# Altium schematic sheet MAIN_PILL_SCH.SchDoc
size 420 x 260 mm; SheetNumber: 1; SheetTotal: 1
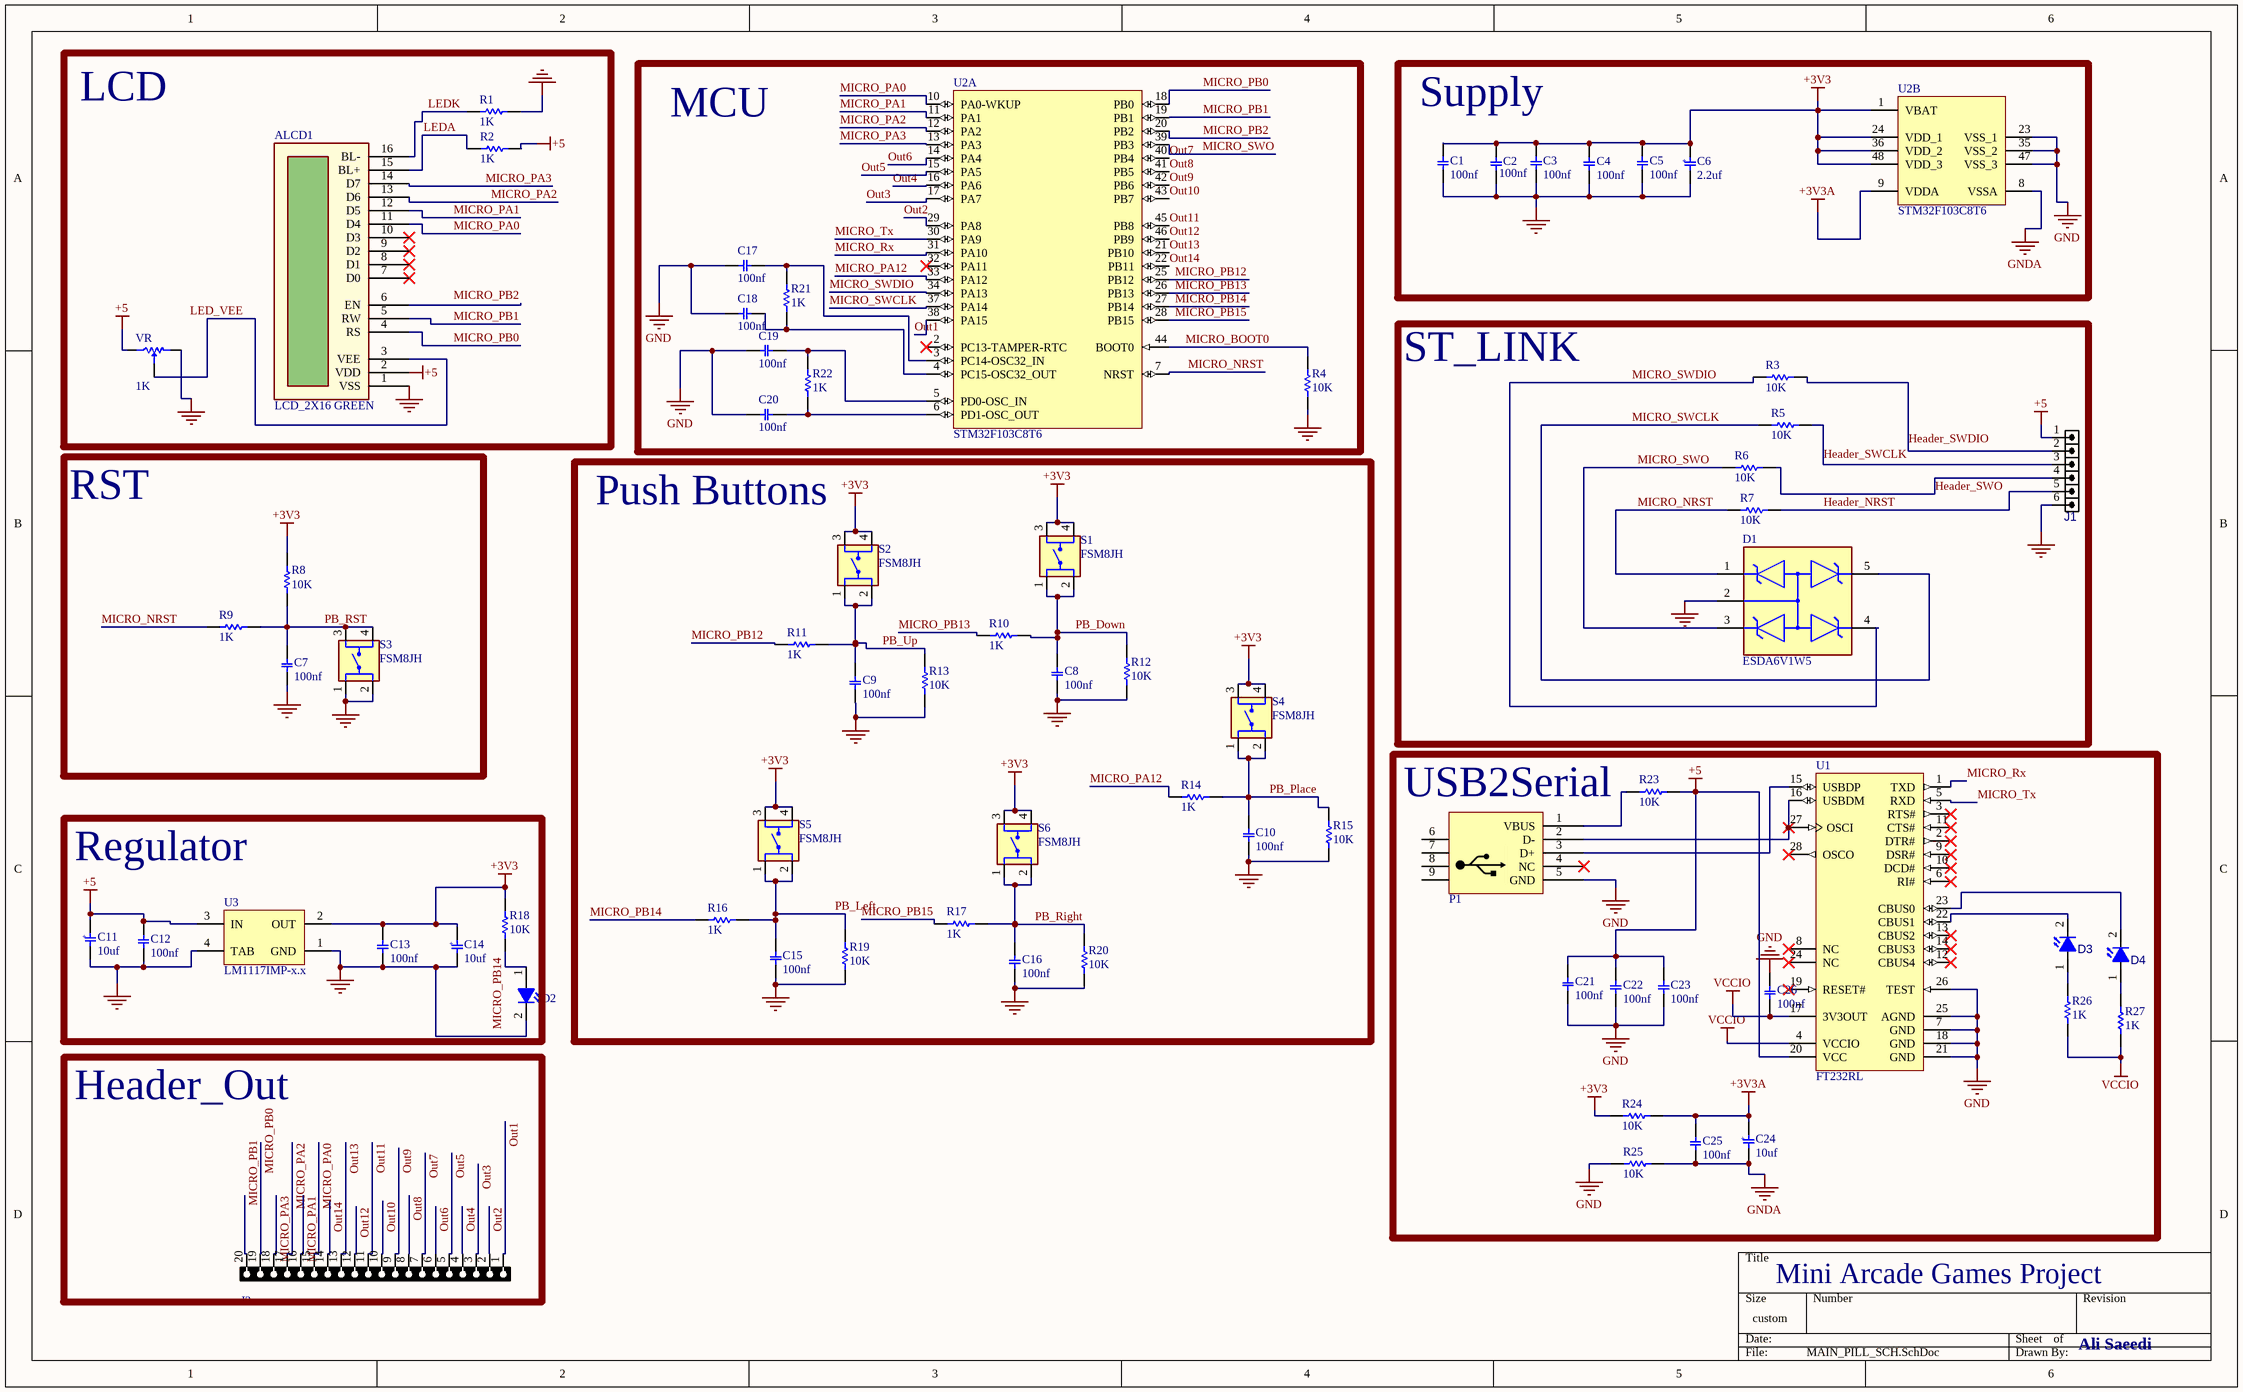
[diagram p0: MAIN_PILL_SCH.SchDoc]

## Parts
ALCD1  LCD_2X16 GREEN  [LCD_2X16 GREEN]
C1  value 100nf  [C0805]  (hidden comment: Capacitor C SMD 0805)
C2  value 100nf  [C0805]  (hidden comment: Capacitor C SMD 0805)
C3  value 100nf  [C0805]  (hidden comment: Capacitor C SMD 0805)
C4  value 100nf  [C0805]  (hidden comment: Capacitor C SMD 0805)
C5  value 100nf  [C0805]  (hidden comment: Capacitor C SMD 0805)
C6  value 2.2uf  [Cap_2_(2.5mm)]  (hidden comment: Capacitor Electrical THD)
C7  value 100nf  [C0805]  (hidden comment: Capacitor C SMD 0805)
C8  value 100nf  [C0805]  (hidden comment: Capacitor C SMD 0805)
C9  value 100nf  [C0805]  (hidden comment: Capacitor C SMD 0805)
C10  value 100nf  [C0805]  (hidden comment: Capacitor C SMD 0805)
C11  value 10uf  [Cap_2_(2.5mm)]  (hidden comment: Capacitor Electrical THD)
C12  value 100nf  [C0805]  (hidden comment: Capacitor C SMD 0805)
C13  value 100nf  [C0805]  (hidden comment: Capacitor C SMD 0805)
C14  value 10uf  [Cap_2_(2.5mm)]  (hidden comment: Capacitor Electrical THD)
C15  value 100nf  [C0805]  (hidden comment: Capacitor C SMD 0805)
C16  value 100nf  [C0805]  (hidden comment: Capacitor C SMD 0805)
C17  value 100nf  [C0805]  (hidden comment: Capacitor C SMD 0805)
C18  value 100nf  [C0805]  (hidden comment: Capacitor C SMD 0805)
C19  value 100nf  [C0805]  (hidden comment: Capacitor C SMD 0805)
C20  value 100nf  [C0805]  (hidden comment: Capacitor C SMD 0805)
C21  value 100nf  [C0805]  (hidden comment: Capacitor C SMD 0805)
C22  value 100nf  [C0805]  (hidden comment: Capacitor C SMD 0805)
C23  value 100nf  [C0805]  (hidden comment: Capacitor C SMD 0805)
C24  value 10uf  [Cap_2_(2.5mm)]  (hidden comment: Capacitor Electrical THD)
C25  value 100nf  [C0805]  (hidden comment: Capacitor C SMD 0805)
C26  value 100nf  [C0805]  (hidden comment: Capacitor C SMD 0805)
D1  ESDA6V1W5  [FP-SOT323-5L-MFG]
D2  LED THD 5mm  [LED THD 5mm (Green)]  (value not drawn)
D3  LED SMD 1206  [LED SMD 1206 (Blue)]  (value not drawn)
D4  LED SMD 1206  [LED SMD 1206 (Blue)]  (value not drawn)
J1  HDRM6  [HDRS_M_1X6]  (value not drawn)
J2  HDRF20  [HDR_F_1X20]  (value not drawn)
P1  USB mini  [USB/SM0.8-6H5]  (value not drawn)
R1  value 1K  [SMD-1206-RES]  (hidden comment: Resistor SMD 1206)
R2  value 1K  [SMD-1206-RES]  (hidden comment: Resistor SMD 1206)
R3  value 10K  [SMD-1206-RES]  (hidden comment: Resistor SMD 1206)
R4  value 10K  [SMD-1206-RES]  (hidden comment: Resistor SMD 1206)
R5  value 10K  [SMD-1206-RES]  (hidden comment: Resistor SMD 1206)
R6  value 10K  [SMD-1206-RES]  (hidden comment: Resistor SMD 1206)
R7  value 10K  [SMD-1206-RES]  (hidden comment: Resistor SMD 1206)
R8  value 10K  [SMD-1206-RES]  (hidden comment: Resistor SMD 1206)
R9  value 1K  [SMD-1206-RES]  (hidden comment: Resistor SMD 1206)
R10  value 1K  [SMD-1206-RES]  (hidden comment: Resistor SMD 1206)
R11  value 1K  [SMD-1206-RES]  (hidden comment: Resistor SMD 1206)
R12  value 10K  [SMD-1206-RES]  (hidden comment: Resistor SMD 1206)
R13  value 10K  [SMD-1206-RES]  (hidden comment: Resistor SMD 1206)
R14  value 1K  [SMD-1206-RES]  (hidden comment: Resistor SMD 1206)
R15  value 10K  [SMD-1206-RES]  (hidden comment: Resistor SMD 1206)
R16  value 1K  [SMD-1206-RES]  (hidden comment: Resistor SMD 1206)
R17  value 1K  [SMD-1206-RES]  (hidden comment: Resistor SMD 1206)
R18  value 10K  [SMD-1206-RES]  (hidden comment: Resistor SMD 1206)
R19  value 10K  [SMD-1206-RES]  (hidden comment: Resistor SMD 1206)
R20  value 10K  [SMD-1206-RES]  (hidden comment: Resistor SMD 1206)
R21  value 1K  [R2W_AX_VER]  (hidden comment: Resistor THD)
R22  value 1K  [R2W_AX_VER]  (hidden comment: Resistor THD)
R23  value 10K  [SMD-1206-RES]  (hidden comment: Resistor SMD 1206)
R24  value 10K  [SMD-1206-RES]  (hidden comment: Resistor SMD 1206)
R25  value 10K  [SMD-1206-RES]  (hidden comment: Resistor SMD 1206)
R26  value 1K  [SMD-1206-RES]  (hidden comment: Resistor SMD 1206)
R27  value 1K  [SMD-1206-RES]  (hidden comment: Resistor SMD 1206)
S1  FSM8JH  [SW_FSM8JH]
S2  FSM8JH  [SW_FSM8JH]
S3  FSM8JH  [SW_FSM8JH]
S4  FSM8JH  [SW_FSM8JH]
S5  FSM8JH  [SW_FSM8JH]
S6  FSM8JH  [SW_FSM8JH]
U1  FT232RL  [FTDI-SSOP-28_M]
U2  STM32F103C8T6  [STM-LQFP48_N]  (parts A,B of 2)
U3  LM1117IMP-x.x  [SOT223]
VR  value 1K  [Volume]  (hidden comment: Volume)

## Blocks framed on the sheet
LCD: ALCD1 R1 R2 VR
MCU: C17-C20 R4 R21 R22 U2
Supply: C1-C6 U2
ST_LINK: D1 J1 R3 R5-R7
RST: C7 R8 R9 S3
Push Buttons: C8-C10 C15 C16 R10-R17 R19 R20 S1 S2 S4-S6
USB2Serial: C21-C26 D3 D4 P1 R23-R27 U1
Regulator: C11-C14 D2 R18 U3
Header_Out: J2

## Nets
+3V3: C1.2 C2.2 C3.2 C4.2 C5.2 C6.1 C13.2 C14.1 R8.2 R18.2 R24.1 S1.3 S1.4 S2.3 S2.4 S4.3 S4.4 S5.3 S5.4 S6.3 S6.4 U2.1(VBAT) U2.24(VDD_1) U2.36(VDD_2) U2.48(VDD_3) U3.2(OUT)
+3V3A: C24.1 C25.2 R24.2 U2.9(VDDA)
+5: ALCD1.2(VDD) C11.1 C12.2 C21.2 C22.2 C23.2 J1.1 R2.2 R23.2 U1.20(VCC) U3.3(IN) VR.1(CCW)
GND: ALCD1.1(VSS) C1.1 C2.1 C3.1 C4.1 C5.1 C6.2 C7.1 C8.1 C9.1 C10.1 C11.2 C12.1 C13.1 C14.2 C15.1 C16.1 C17.2 C18.2 C19.2 C20.2 C21.1 C22.1 C23.1 C26.2 D1.2(COMMON_ANODE) D2.2(CATHODE) J1.6 P1.5(GND) R1.2 R4.1 R12.1 R13.1 R15.1 R19.1 R20.1 R25.1 S3.1 S3.2 U1.7(GND) U1.18(GND) U1.21(GND) U1.25(AGND) U1.26(TEST) U2.23(VSS_1) U2.35(VSS_2) U2.47(VSS_3) U3.1(GND) U3.4(TAB) VR.2(CW)
GNDA: C24.2 C25.1 R25.2 U2.8(VSSA)
VCCIO: C26.1 R26.1 R27.1 U1.4(VCCIO) U1.17(3V3OUT)
Header_NRST: J1.5 R7.2
Header_SWCLK: J1.3 R5.2
Header_SWDIO: J1.2 R3.2
Header_SWO: J1.4 R6.2
LED_VEE: ALCD1.3(VEE) VR.3(Setpoint)
LEDA: ALCD1.15(BL+) R2.1
LEDK: ALCD1.16(BL-) R1.1
MICRO_BOOT0: R4.2 U2.44(BOOT0)
MICRO_NRST: D1.1(1_CATHODE) R7.1 R9.2 U2.7(NRST)
MICRO_PA0: ALCD1.11(D4) J2.15 U2.10(PA0-WKUP)
MICRO_PA1: ALCD1.12(D5) J2.16 U2.11(PA1)
MICRO_PA2: ALCD1.13(D6) J2.17 U2.12(PA2)
MICRO_PA3: ALCD1.14(D7) J2.18 U2.13(PA3)
MICRO_PA12: R14.2 U2.33(PA12)
MICRO_PB0: ALCD1.4(RS) J2.19 U2.18(PB0)
MICRO_PB1: ALCD1.5(RW) J2.20 U2.19(PB1)
MICRO_PB2: ALCD1.6(EN) U2.20(PB2)
MICRO_PB12: R11.2 U2.25(PB12)
MICRO_PB13: R10.2 U2.26(PB13)
MICRO_PB14: D2.1(ANODE) R16.2 R18.1 U2.27(PB14)
MICRO_PB15: R17.2 U2.28(PB15)
MICRO_Rx: U1.1(TXD) U2.31(PA10)
MICRO_SWCLK: D1.5(4_CATHODE) R5.1 U2.37(PA14)
MICRO_SWDIO: D1.4(3_CATHODE) R3.1 U2.34(PA13)
MICRO_SWO: D1.3(2_CATHODE) R6.1 U2.39(PB3)
MICRO_Tx: U1.5(RXD) U2.30(PA9)
Out1: J2.1 U2.38(PA15)
Out2: J2.2 U2.29(PA8)
Out3: J2.3 U2.17(PA7)
Out4: J2.4 U2.16(PA6)
Out5: J2.5 U2.15(PA5)
Out6: J2.6 U2.14(PA4)
Out7: J2.7 U2.40(PB4)
Out8: J2.8 U2.41(PB5)
Out9: J2.9 U2.42(PB6)
Out10: J2.10 U2.43(PB7)
Out11: J2.11 U2.45(PB8)
Out12: J2.12 U2.46(PB9)
Out13: J2.13 U2.21(PB10)
Out14: J2.14 U2.22(PB11)
PB_Down: C8.2 R10.1 R12.2 S1.1 S1.2
PB_Left: C15.2 R16.1 R19.2 S5.1 S5.2
PB_Place: C10.2 R14.1 R15.2 S4.1 S4.2
PB_Right: C16.2 R17.1 R20.2 S6.1 S6.2
PB_RST: C7.2 R8.1 R9.1 S3.3 S3.4
PB_Up: C9.2 R11.1 R13.2 S2.1 S2.2
NetC17_1: C17.1 R21.2 U2.3(PC14-OSC32_IN)
NetC18_1: C18.1 R21.1 U2.4(PC15-OSC32_OUT)
NetC19_1: C19.1 R22.2 U2.5(PD0-OSC_IN)
NetC20_1: C20.1 R22.1 U2.6(PD1-OSC_OUT)
NetD3_1: D3.1(ANODE) R26.2
NetD3_2: D3.2(CATHODE) U1.22(CBUS1)
NetD4_1: D4.1(ANODE) R27.2
NetD4_2: D4.2(CATHODE) U1.23(CBUS0)
NetP1_1: P1.1(VBUS) R23.1
NetP1_2: P1.2(D-) U1.16(USBDM) U1.27(OSCI)
NetP1_3: P1.3(D+) U1.15(USBDP)

Not connected (* = marked no-connect by the designer): ALCD1 7(D0)* 8(D1)* 9(D2)* 10(D3)*; P1 4(NC)* 6 7 8 9; U1 2(DTR#)* 3(RTS#)* 6(RI#)* 8(NC)* 9(DSR#)* 10(DCD#)* 11(CTS#)* 12(CBUS4)* 13(CBUS2)* 14(CBUS3)* 19(RESET#)* 24(NC)* 28(OSCO)*; U2 2(PC13-TAMPER-RTC)* 32(PA11)*

## Notes on the sheet
- Mini Arcade Games Project
- Ali Saeedi
- (in symbol Capacitor Electrical THD) +

## Library data of the parts
D1 = CMP-12225-000010-1: TVS DIODE 3V SOT323-5; Manufacturer: STMicroelectronics; Value: 90pF; Max Junction Temp: +125°C; Breakdown Voltage: 6.1V; Standoff Height: 0mm; Number Of Channels: 2; Peak Pulse Power: 150W; Direction: Unidirectional; Temperature Range Low: -40°C; Temperature Range High: +125°C; Octopart: https://octopart.com/esda6v1w5-stmicroelectronics-39557953; Device Class L1: Circuit Protection; Digikey Description: TVS DIODE 3V SOT323-5; Mouser Description: TVS Diodes / ESD Suppressors 6.1V 150W Unidirect; Capacitance: 90pF; Device Class L2: TVS Diodes; Reverse Standoff Voltage: 3V; Category: Diode; Ipc Land Pattern Name: SOT65P210X95-5; Lead Free: Yes; Manufacturer Part Number: ESDA6V1W5; ComponentLink2Description: Datasheet; Height: 1.1mm; Temperature: -40°C to +125°C; Package: SOT323-5L; Device Class L3: unset; RoHS: TRUE; ComponentLink2URL: https://www.st.com/resource/en/datasheet/esdaxxxwx.pdf; Automotive: No
J1 = HDRS_M_1X6: CONN, HEADER, Male, pitch: 2.54mm, 6POS, SMD; MANF_P#: PBC36SAAN; MANF: Sullins; DESC: DESCRIPTION; ASSEMBLY: ASSEMBLY; PARAM: PARAM; PRICE: PRICE; Website Smart World: https://www.smartw.ir/; VALUE: HDRM6
J2 = HDR_F_1X20: CONN, HEADER, Female, pitch: 2.54mm, 20POS; Website Smart World: https://www.smartw.ir/; VALUE: HDRF20
P1 = USB mini: mini USB Connector; DatasheetVersion: 2021; ComponentLink1Description: Website Smart World; ComponentLink1URL: https://www.smartw.ir/; ComponentLink2Description: Telegram; ComponentLink2URL: https://t.me/altium_smartw; ComponentLink3Description: Instagram; ComponentLink3URL: https://Instagram.com/smartgw.ir
S1-S6 = FSM8JH: Tactile Switch SPST-NO Top Actuated Through Hole; MF: TE Connectivity; Check_prices: https://www.snapeda.com/parts/FSM8JH/TE+Connectivity+ALCOSWITCH+Switches/view-part/?ref=eda; Value: *; Availability: In Stock; MP: FSM8JH; Price: None; Package: None; SnapEDA_Link: https://www.snapeda.com/parts/FSM8JH/TE+Connectivity+ALCOSWITCH+Switches/view-part/?ref=snap
U1 = CMP-2000-05029-1: IC USB FS SERIAL UART 28-SSOP; Manufacturer: FTDI; Receive FIFO: 256B; Number of Channels per Chip: 1; Maximum Data Rate: 3MBd; Transmit FIFO: 128B; Dimensions: 10.2x5.3x1.75mm; Mounting Type: SurfaceMount; Height: 1.75mm; Package Type: SSOP; Datasheet Version: Rev. 1.04, 02/2006; Width: 5.3mm; Manufacturer URL: http://www.ftdichip.com/; Datasheet URL: http://datasheet.octopart.com/FT232RL-FTDI-datasheet-120501.pdf; Maximum Operating Temperature: +85degC; Minimum Operating Temperature: -40degC; Pin Count: 28; Length: 10.2mm
U2 = STM32F103C8T6: ARM Cortex-M3 32-bit MCU, 64 KB Flash, 20 KB Internal RAM, 37 I/Os, 48-pin LQFP, -40 to 85 degC, Tray; ComponentLink1Description: Website Smart World; ComponentLink1URL: https://www.smartw.ir/
U3 = LM1117IMP-x.x: x.x Volt, 800mA Low-Dropout Linear Regulator, 4-pin SOT-223; ComponentLink1Description: Website Smart World; ComponentLink1URL: https://www.smartw.ir/; ComponentLink2Description: Telegram; ComponentLink2URL: https://t.me/altium_smartw; ComponentLink3Description: Instagram; ComponentLink3URL: https://Instagram.com/smartgw.ir; DatasheetVersion: 2021
VR = Volume: Email: Razi.vesali@gmail.com; LatestRevisionDate: 17-Jul-2016; LatestRevisionNote: Re-released for Puplic; Publisher: Seyed Razi vesali (SRV)
C1-C5 C7-C10 C12 C13 C15-C23 C25 C26 = Capacitor C SMD 0805: DatasheetVersion: 2021; ComponentLink1Description: Website Smart World; ComponentLink1URL: https://www.smartw.ir/; ComponentLink2Description: Telegram; ComponentLink2URL: https://t.me/altium_smartw; ComponentLink3Description: Instagram; ComponentLink3URL: https://Instagram.com/smartgw.ir
C6 C11 C14 C24 = Capacitor Electrical THD: DatasheetVersion: 2021; ComponentLink1Description: Website Smart World; ComponentLink1URL: https://www.smartw.ir/; ComponentLink2Description: Telegram; ComponentLink2URL: https://t.me/altium_smartw; ComponentLink3Description: Instagram; ComponentLink3URL: https://Instagram.com/smartgw.ir
D2 = LED THD 5mm: ComponentLink1Description: Website Smart World; ComponentLink1URL: https://www.smartw.ir/; ComponentLink2Description: Telegram; ComponentLink2URL: https://t.me/altium_smartw; DatasheetVersion: 2021; ComponentLink3Description: Instagram; ComponentLink3URL: https://Instagram.com/smartgw.ir
D3 D4 = LED SMD 1206: ComponentLink1Description: Website Smart World; ComponentLink1URL: https://www.smartw.ir/; ComponentLink2Description: Telegram; ComponentLink2URL: https://t.me/altium_smartw; ComponentLink3Description: Instagram; ComponentLink3URL: https://Instagram.com/smartgw.ir; DatasheetVersion: 2021
R1-R20 R23-R27 = Resistor SMD 1206: DatasheetVersion: 2021; ComponentLink1Description: Website Smart World; ComponentLink1URL: https://www.smartw.ir/; ComponentLink2Description: Telegram; ComponentLink2URL: https://t.me/altium_smartw; ComponentLink3Description: Instagram; ComponentLink3URL: https://Instagram.com/smartgw.ir
R21 R22 = Resistor THD: DatasheetVersion: 2021; ComponentLink1Description: Website Smart World; ComponentLink1URL: https://www.smartw.ir/; ComponentLink2Description: Telegram; ComponentLink2URL: https://t.me/altium_smartw; ComponentLink3Description: Instagram; ComponentLink3URL: https://Instagram.com/smartgw.ir